# Altium schematic sheet yyb_v2.5_sensor.SchDoc
size A4
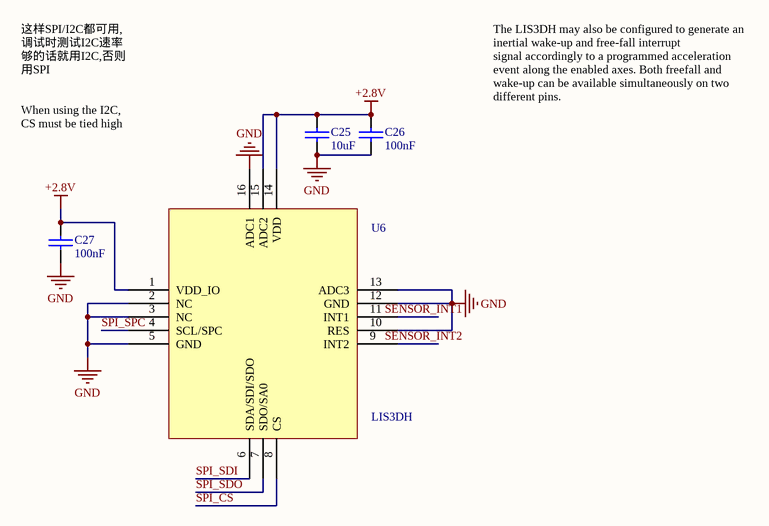
[diagram p0: yyb_v2.5_sensor.SchDoc]

## Parts
C25  10uF  [0603C]
C26  100nF  [0603C]
C27  100nF  [0603C]
U6  LIS3DH  [LGA16R50P7X5_300X300X100]

## Nets
+2.8V: C25.1 C26.1 C27.1 U6.1(VDD_IO) U6.14(VDD) U6.15(ADC2)
GND: C25.2 C26.2 C27.2 U6.2(NC) U6.3(NC) U6.5(GND) U6.10(RES) U6.12(GND) U6.13(ADC3) U6.16(ADC1)
SPI_CS: U6.8(CS)
SPI_SDI: U6.6(SDA/SDI/SDO)
SPI_SDO: U6.7(SDO/SA0)
SPI_SPC: U6.4(SCL/SPC)

Not connected (* = marked no-connect by the designer): U6 9(INT2) 11(INT1)

## Notes on the sheet
- 这样SPI/I2C都可用,调试时测试I2C速率够的话就用I2C,否则用SPI
- When using the I2C, CS must be tied high
- The LIS3DH may also be configured to generate an inertial wake-up and free-fall interrupt
  signal accordingly to a programmed acceleration event along the enabled axes. Both freefall and wake-up can be available simultaneously on two different pins.
- Labels drawn without touching a wire or pin: SENSOR_INT1, SENSOR_INT2

## Library data of the parts
C25-C27 = CAP: Capacitor